# EAGLE design cargador3 (EAGLE 9.4.2)
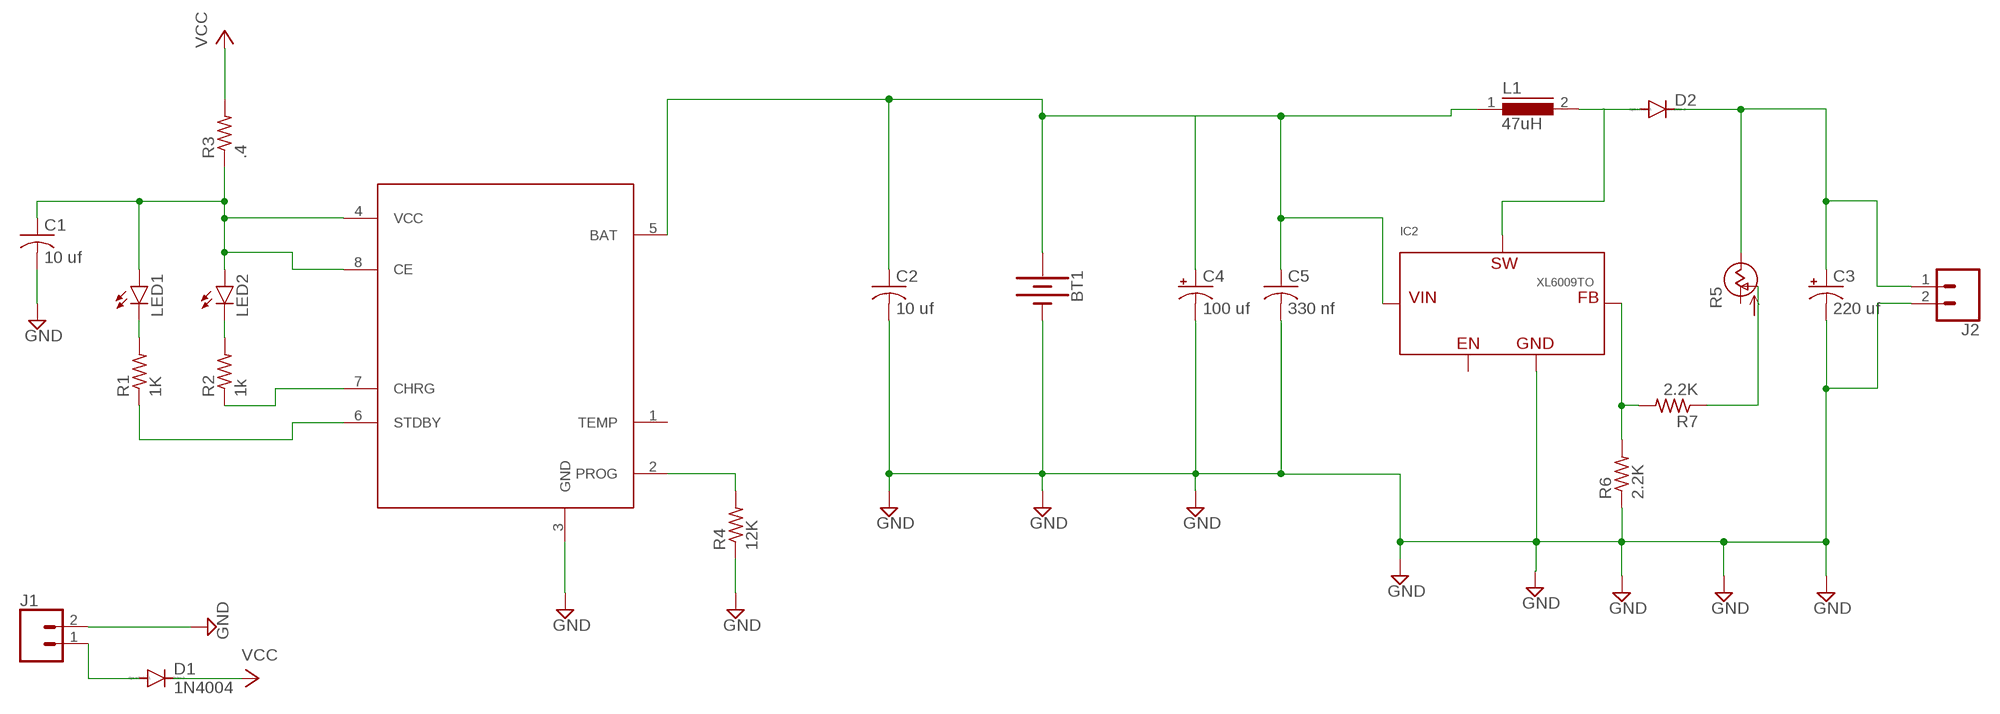
[diagram p0: schematic, sheet 1]

## Parts
BT1  BATTERY-18650  [BATTERY_18650-HOLDER]
C1  10 uf  C-USC0402  [C0402]
C2  10 uf  C-USC0402  [C0402]
C3  220 uf  CPOL-US140CLH-1010  [140CLH-1010]
C4  100 uf  CPOL-US140CLH-1010  [140CLH-1010]
C5  330 nf  C-USC0805  [C0805]
D1  1N4004  [DO41-10]
D2  DIODE-DO214AA  [DO214AA]
IC2  XL6009TO  [TO263-5L]
J1  CONN_02  [1X02]
J2  CONN_02  [1X02]
L1  47uH  SRR1210  [SRR1210]
LED1  LEDSMART-LED  [SMART-LED]
LED2  LEDSMART-LED  [SMART-LED]
R1  1K  R-US_R1206  [R1206]
R2  1k  R-US_R1206  [R1206]
R3  .4  R-US_R2010  [R2010]
R4  12K  R-US_R0402  [R0402]
R5  POTTRB64Y  [B64Y]
R6  2.2K  R-US_R2010  [R2010]
R7  2.2K  R-US_R2010  [R2010]
TC4056  TC4056A  [TC4056A]

## Nets
GND: BT1.GND@1(-) C1.2 C2.2 C3.- C4.- C5.2 IC2.1(GND) J1.2 J2.2 R4.1 R6.1 TC4056.3(GND)
N$1: LED1.B(C) R1.2
N$2: LED2.B(C) R2.2
N$3: R4.2 TC4056.2(PROG)
N$4: R2.1 TC4056.7(CHRG)
N$5: R1.1 TC4056.6(STDBY)
N$6: C1.1 LED1.A LED2.A R3.1 TC4056.4(VCC) TC4056.8(CE)
N$7: D2.A IC2.3(SW) L1.2
N$8: D1.A J1.1
N$9: R5.S(OUT) R7.1
N$10: C3.+ D2.C J2.1 R5.E(VSS)
N$11: BT1.PWR@1(+) C2.1 C4.+ C5.1 IC2.4(VIN) L1.1 TC4056.5(BAT)
N$12: IC2.5(FB) R6.2 R7.2
VCC: D1.C R3.2
Unconnected: IC2.2(EN) R5.A(VDD) TC4056.1(TEMP)

## Library data of the parts
BT1 = SparkFun-Batteries:BATTERY: Battery - Single Cell A variety of battery chemistries, sizes, and footprints. Device List: 20MM_PTH - Coin Cell Battery Holder - 20mm (PTH) <https://www.sparkfun.com/products/783> 20MM_PTH_KIT- Coin Cell battery Holder - 20 mm (PTH) <http://www.sparkfun.com/products/783>kit version with special mask 6.8MM_PTH - Coin Cell Battery Holder - 6.8MM(SMD) <https://www.digikey.com/product-detail/en/seiko-instruments/MS621FE-FL11E/728-1057-ND/1889208?WT.srch=1&gclid=CNOQ5a6LzdQCFZS2wAodXCkE0g> 12MM_SMD - Coin Cell Battery Holder - 12mm (SMD) <https://www.sparkfun.com/products/10592> 12MM_PTH - Coin Cell Battery Holder - 12mm (PTH) <https://www.sparkfun.com/products/7948> 20MM_SMD - 20mm Coin Cell Battery Holder (SMD) (2 legs) Used on the Big Time Watch Kit <https://www.sparkfun.com/products/11734> 20MM_SMD_4LEGS - Coin Cell Battery Holder - 20mm (SMD) <https://www.sparkfun.com/products/11892> 20MM_SMD_4LEGS_OVERPASTE - Coin Cell Battery Holder - 20mm (SMD) <https://www.sparkfun.com/products/11892> (Over-paste on the legs) 24.5MM_PTH - Coin Cell Battery Holder - 24.5mm (PTH) <https://www.sparkfun.com/products/8863> 9V - 9V Battery Holder - PC Mount Used on the SparkFun SparkPunk Sound Kit <https://www.sparkfun.com/products/11177> and SparkFun SparkPunk Sequencer Kit <https://www.sparkfun.com/products/12707> 18650 - Battery Holder - 18650 (PTH) <https://www.sparkfun.com/products/13113> AA - Battery Holder - 1xAA (PTH) <https://www.sparkfun.com/products/7949> AAA - Battery Holder - 1xAAA (PTH) <https://www.sparkfun.com/products/12718> AA_KIT - Battery Holder - 1xAA (PTH) <https://www.sparkfun.com/products/7949> Special kit package - pads only have exposed copper on one side of the board. AAA_KIT - Battery Holder - 1xAAA (PTH) <https://www.sparkfun.com/products/12718> Special kit package - pads only have exposed copper on one side of the board.; PROD_ID: BATT-12327; SF_SKU: PRT-13113
C1 C2 C5 = rcl:C-US: CAPACITOR, American symbol; SPICEPREFIX: C
C3 = rcl-2:CPOL-US: POLARIZED CAPACITOR, American symbol; SPICEPREFIX: C
C4 = rcl-2:CPOL-US: POLARIZED CAPACITOR, American symbol
D1 = diode:1N4004: DIODE general purpose rectifier, 1 A
D2 = diode:DIODE-: DIODE
IC2 = hacesoft:XL6009
J1 J2 = SparkFun-Connectors:CONN_02: Multi connection point. Often used as Generic Header-pin footprint for 0.1 inch spaced/style header connections On any of the 0.1 inch spaced packages, you can populate with these: Break Away Headers - Straight <https://www.sparkfun.com/products/116> (PRT-00116) Break Away Male Headers - Right Angle <https://www.sparkfun.com/products/553> (PRT-00553) Female Headers <https://www.sparkfun.com/products/115> (PRT-00115) Break Away Headers - Machine Pin <https://www.sparkfun.com/products/117> (PRT-00117) Break Away Female Headers - Swiss Machine Pin <https://www.sparkfun.com/products/743> (PRT-00743) For SCREWTERMINALS and SPRING TERMINALS visit here: Screw Terimnals on SparkFun.com <https://www.sparkfun.com/search/results?term=Screw+Terminals> (5mm/3.5mm/2.54mm spacing) This device is also useful as a general connection point to wire up your design to another part of your project. Our various solder wires solder well into these plated through hole pads. Hook-Up Wire - Assortment (Stranded, 22 AWG) <https://www.sparkfun.com/products/11375> (PRT-11375) Hook-Up Wire - Assortment (Solid Core, 22 AWG) <https://www.sparkfun.com/products/11367> (PRT-11367) View the entire wire category on our website here <https://www.sparkfun.com/categories/141> Special notes: Molex polarized connector foot print use with: PRT-08233 with associated crimp pins and housings. 2.54_SCREWTERM for use with PRT-10571. 3.5mm Screw Terminal footprints for PRT-08084 5mm Screw Terminal footprints for use with PRT-08432
L1 = inductors-2:SRR1210: SRR1210 Series - Shielded SMD Power Inductors Features : Available in E12 series Height of 4.3 mm Current rating up to 9 A RoHS compliant Applications : Input/output of DC/DC converters Power supplies
LED1 LED2 = led:LED: LED OSRAM: - CHIPLED LG R971, LG N971, LY N971, LG Q971, LY Q971, LO R971, LY R971 LH N974, LH R974 LS Q976, LO Q976, LY Q976 LO Q996 - Hyper CHIPLED LW Q18S LB Q993, LB Q99A, LB R99A - SideLED LS A670, LO A670, LY A670, LG A670, LP A670 LB A673, LV A673, LT A673, LW A673 LH A674 LY A675 LS A676, LA A676, LO A676, LY A676, LW A676 LS A679, LY A679, LG A679 - Hyper Micro SIDELED® LS Y876, LA Y876, LO Y876, LY Y876 LT Y87S - SmartLED LW L88C, LW L88S LB L89C, LB L89S, LG L890 LS L89K, LO L89K, LY L89K LS L896, LA L896, LO L896, LY L896 - TOPLED LS T670, LO T670, LY T670, LG T670, LP T670 LSG T670, LSP T670, LSY T670, LOP T670, LYG T670 LG T671, LOG T671, LSG T671 LB T673, LV T673, LT T673, LW T673 LH T674 LS T676, LA T676, LO T676, LY T676, LB T676, LH T676, LSB T676, LW T676 LB T67C, LV T67C, LT T67C, LS T67K, LO T67K, LY T67K, LW E67C LS E67B, LA E67B, LO E67B, LY E67B, LB E67C, LV E67C, LT E67C LW T67C LS T679, LY T679, LG T679 LS T770, LO T770, LY T770, LG T770, LP T770 LB T773, LV T773, LT T773, LW T773 LH T774 LS E675, LA E675, LY E675, LS T675 LS T776, LA T776, LO T776, LY T776, LB T776 LHGB T686 LT T68C, LB T68C - Hyper Mini TOPLED® LB M676 - Mini TOPLED Santana® LG M470 LS M47K, LO M47K, LY M47K Source: http://www.osram.convergy.de LUXEON: - LUMILED® LXK2-PW12-R00, LXK2-PW12-S00, LXK2-PW14-U00, LXK2-PW14-V00 LXK2-PM12-R00, LXK2-PM12-S00, LXK2-PM14-U00 LXK2-PE12-Q00, LXK2-PE12-R00, LXK2-PE12-S00, LXK2-PE14-T00, LXK2-PE14-U00 LXK2-PB12-K00, LXK2-PB12-L00, LXK2-PB12-M00, LXK2-PB14-N00, LXK2-PB14-P00, LXK2-PB14-Q00 LXK2-PR12-L00, LXK2-PR12-M00, LXK2-PR14-Q00, LXK2-PR14-R00 LXK2-PD12-Q00, LXK2-PD12-R00, LXK2-PD12-S00 LXK2-PH12-R00, LXK2-PH12-S00 LXK2-PL12-P00, LXK2-PL12-Q00, LXK2-PL12-R00 Source: www.luxeon.com KINGBRIGHT: KA-3528ASYC Source: www.kingbright.com
R1-R4 R6 R7 = rcl:R-US_: RESISTOR, American symbol; SPICEPREFIX: R
R5 = tango:POTTR: POTENTIOMETER
TC4056 = TC4056A:TC4056A

## Board
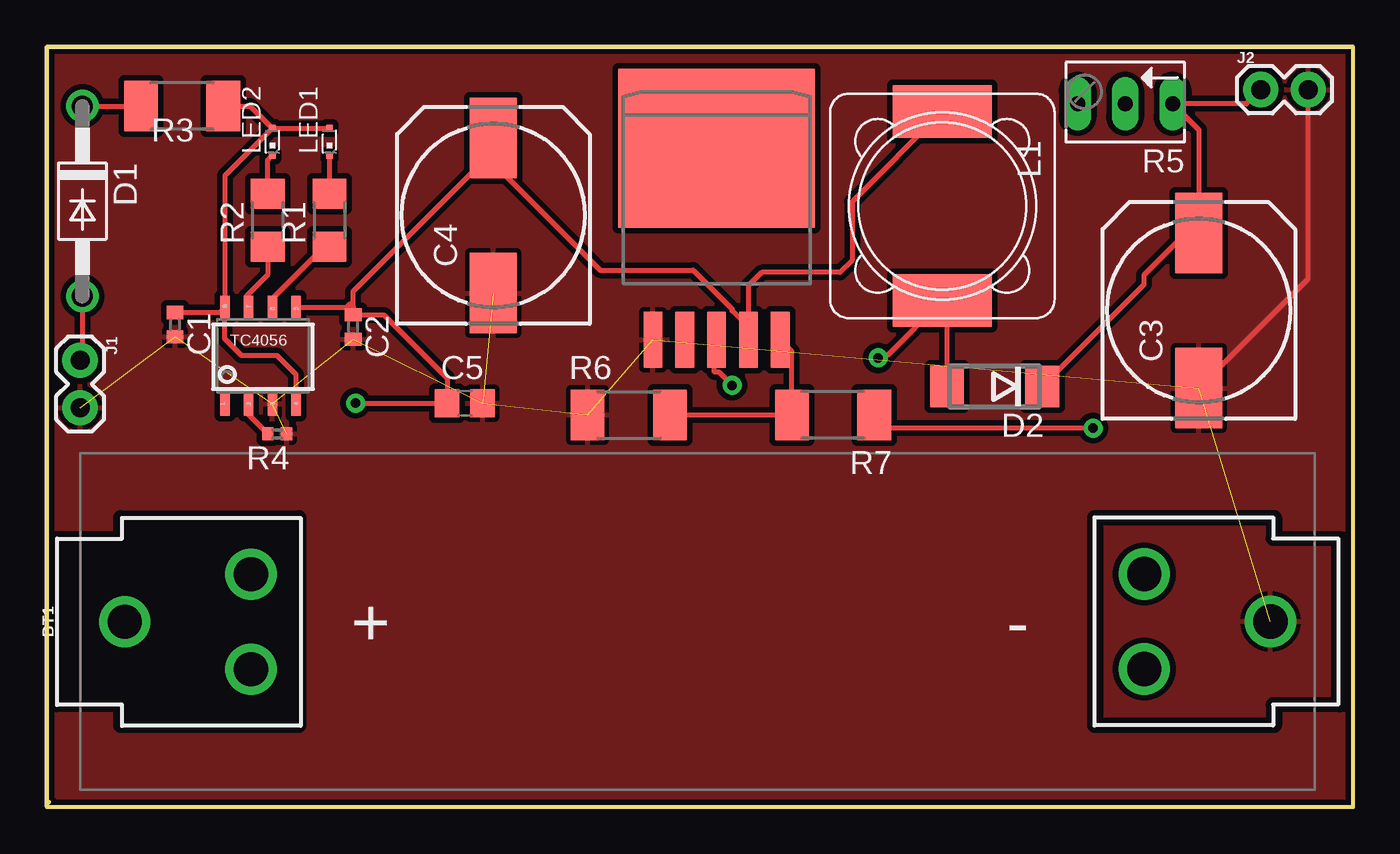
[diagram p1: board, top side]
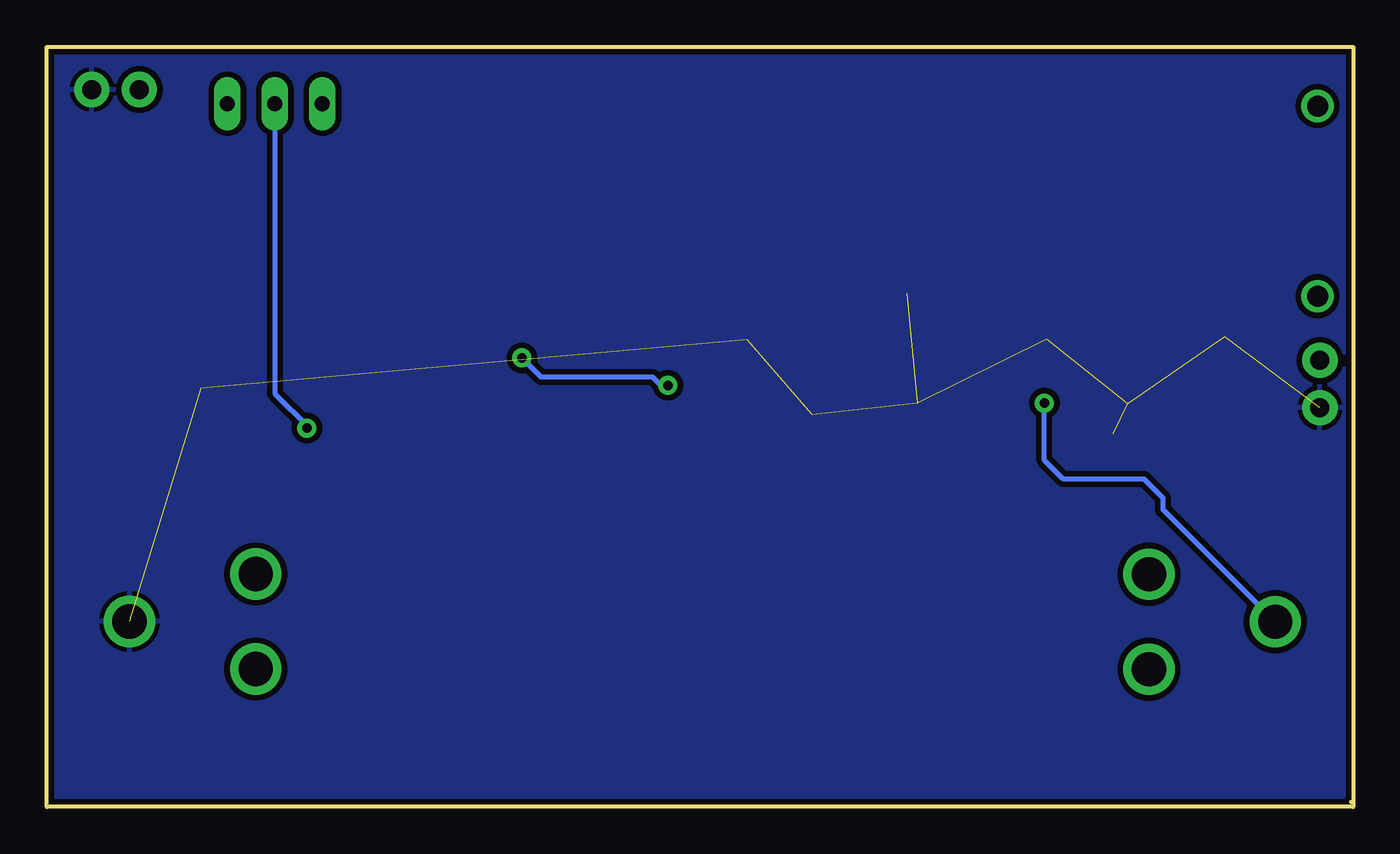
[diagram p2: board, bottom side, seen from below]

Size 69.85 x 40.64 mm. Coordinates in mm from the lower left corner, seen from the top.
Outline: 0,0.25 0.13,0.25
Outline: 0,0 69.85,0 69.85,40.64 0,40.64 0,0
Copper layers (1*16): Top 0.035mm / dielectric 1.5mm / Bottom 0.035mm
Design rules "SparkFun": minimum track width 8mil, minimum drill 20mil, track to track 8mil, track to pad 8mil, pad to pad 8mil, via to via 8mil, smd to smd 8mil, copper to edge 8mil, drill to drill 8mil, minimum pad ring 12mil, minimum via ring 10mil, stop-mask expansion 4mil, vias tented up to drill 20mil, thermal gap 10mil

### Footprints (pad centres in the part's own frame; a part is rotated, then mirrored left to right if it is on the bottom)
BATTERY_18650-HOLDER = drill 1.829: GND@1 30.628,0.01; GND@2 23.88,2.55; GND@3 23.88,-2.53; PWR@1 -30.628,-0.01; PWR@2 -23.88,2.53; PWR@3 -23.88,-2.55
C0402 = smd 0.7 x 0.9: 1 -0.65,0; 2 0.65,0
140CLH-1010 = smd 4.3 x 2.5: + 4.15,0; - -4.15,0
C0805 = smd 1.3 x 1.5: 1 -0.95,0; 2 0.95,0
DO41-10 = drill 1.118: A 5.08,0; C -5.08,0
DO214AA = smd 1.8 x 2.2: A 2.55,0; C -2.55,0
TO263-5L = smd 1 x 3: 1 -3.404,-9.568; 2 -1.702,-9.568; 3 0,-9.568; 4 1.702,-9.568; 5 3.404,-9.568 | smd 10.5 x 8.5: TAB 0,0.682
1X02 = drill 1.016 pad 1.88: 1 0,0; 2 2.54,0
SRR1210 = smd 2.8 x 5.3: 1 -5.05,0; 2 5.05,0
SMART-LED = smd 0.35 x 0.35: A 0,0.725; B 0,-0.725
R1206 = smd 1.6 x 1.803: 1 -1.422,0; 2 1.422,0
R2010 = smd 1.8 x 2.7: 1 -2.2,0; 2 2.2,0
R0402 = smd 0.6 x 0.7: 1 -0.5,0; 2 0.5,0
B64Y = drill 0.813 long: A 2.54,0; E -2.54,0; S 0,0
TC4056A = smd 0.503 x 1.257: 1 -2.032,-2.578; 2 -0.762,-2.578; 3 0.508,-2.578; 4 1.778,-2.578; 5 1.778,2.578; 6 0.508,2.578; 7 -0.762,2.578; 8 -2.032,2.578

### Placement (x,y rotation side)
BT1  34.8,9.91 0 top
C1  6.86,25.78 270 top
C2  16.38,25.65 270 top
C3  61.6,26.54 90 top
C4  23.88,31.62 90 top
C5  22.35,21.59 0 top
D1  1.91,32.38 270 top
D2  50.67,22.48 180 top
IC2  35.81,34.54 0 top
J1  1.78,23.88 270 top
J2  64.9,38.35 0 top
L1  47.88,32.13 270 top
LED1  15.11,35.56 0 top
LED2  12.06,35.56 0 top
R1  15.11,31.37 90 top
R2  11.81,31.37 90 top
R3  7.24,37.46 180 top
R4  12.32,19.94 180 top
R5  57.66,37.59 180 top
R6  31.11,20.96 0 top
R7  42.04,20.96 180 top
TC4056  11.56,24.13 0 top

### Tracks (layer width: path | path; a pad name or v marks a point on that pad's centre or on a via)
GND  (10 unrouted)
  Top 0.254: C3.- 67.44,28.24 J2.2
  pour Top (isolate 0.305): 0,0 69.85,0 69.85,40.64 0,40.64
  pour Bottom (isolate 0.305): 0,40.64 0,0 69.85,0 69.85,40.64
N$1
  Top 0.254: LED1.B R1.2
N$2
  Top 0.254: R2.2 11.81,34.58 LED2.B
N$3
  Top 0.254: R4.2 10.79,20.96 TC4056.2
N$4
  Top 0.254: R2.1 11.81,28.45 10.67,27.3 10.67,26.84 TC4056.7
N$5
  Top 0.254: TC4056.6 12.06,27.18 14.83,29.95 R1.1
N$6
  Top 0.254: R3.1 10.88,37.46 LED2.A | LED2.A LED1.A | LED2.A 9.53,33.74 TC4056.8 9.51,26.69 | 9.51,26.69 9.25,26.43 C1.1 | TC4056.4 13.33,23.11 12.32,24.13 10.41,24.13 9.51,25.04 9.51,26.69
N$7  (via drill 0.51)
  Top 0.254: D2.A 48.12,26.84 L1.2 44.93,24.13 44.45,24.13 v44.45,24 | v36.64,22.54 35.94,23.24 35.69,23.24 35.69,24.85 IC2.3
  Bottom 0.254: v44.45,24 43.43,22.99 37.47,22.99 36.83,22.35 v36.64,22.54
N$8
  Top 0.254: D1.A 1.91,24 J1.1
N$9  (via drill 0.51)
  Top 0.254: v55.94,20.26 45.15,20.26 44.45,20.96 R7.1
  Bottom 0.254: R5.S 57.66,22.1 55.88,20.32 v55.94,20.26
N$10
  Top 0.254: D2.C 58.67,27.93 58.67,28.45 60.92,30.69 C3.+ 61.6,36.2 R5.E 64.14,37.59 J2.1
N$11  (via drill 0.51)
  Top 0.254: TC4056.5 16.04,26.71 16.26,26.92 16.38,26.8 C2.1 | C2.1 18.02,26.3 21.4,22.92 C5.1 v16.51,21.59 | C2.1 16.38,27.56 23.88,35.05 C4.+ 23.88,34.42 29.59,28.7 34.55,28.7 36.64,26.61 36.64,26.53 37.52,25.65 | L1.1 43.05,32.35 43.05,29.21 42.42,28.57 38.23,28.57 37.52,27.86 37.52,25.65 | 37.52,25.65 IC2.4
  Bottom 0.254: BT1.PWR@1 10.16,15.89 10.16,16.51 11.18,17.53 15.49,17.53 16.51,18.54 v16.51,21.59
N$12
  Top 0.254: R6.2 R7.2 39.84,24.36 IC2.5
VCC
  Top 0.254: D1.C R3.2